# Altium schematic sheet Guidance.SchDoc
size 270 x 306 mm; DocumentNumber: 8; SheetNumber: 8; SheetTotal: 8
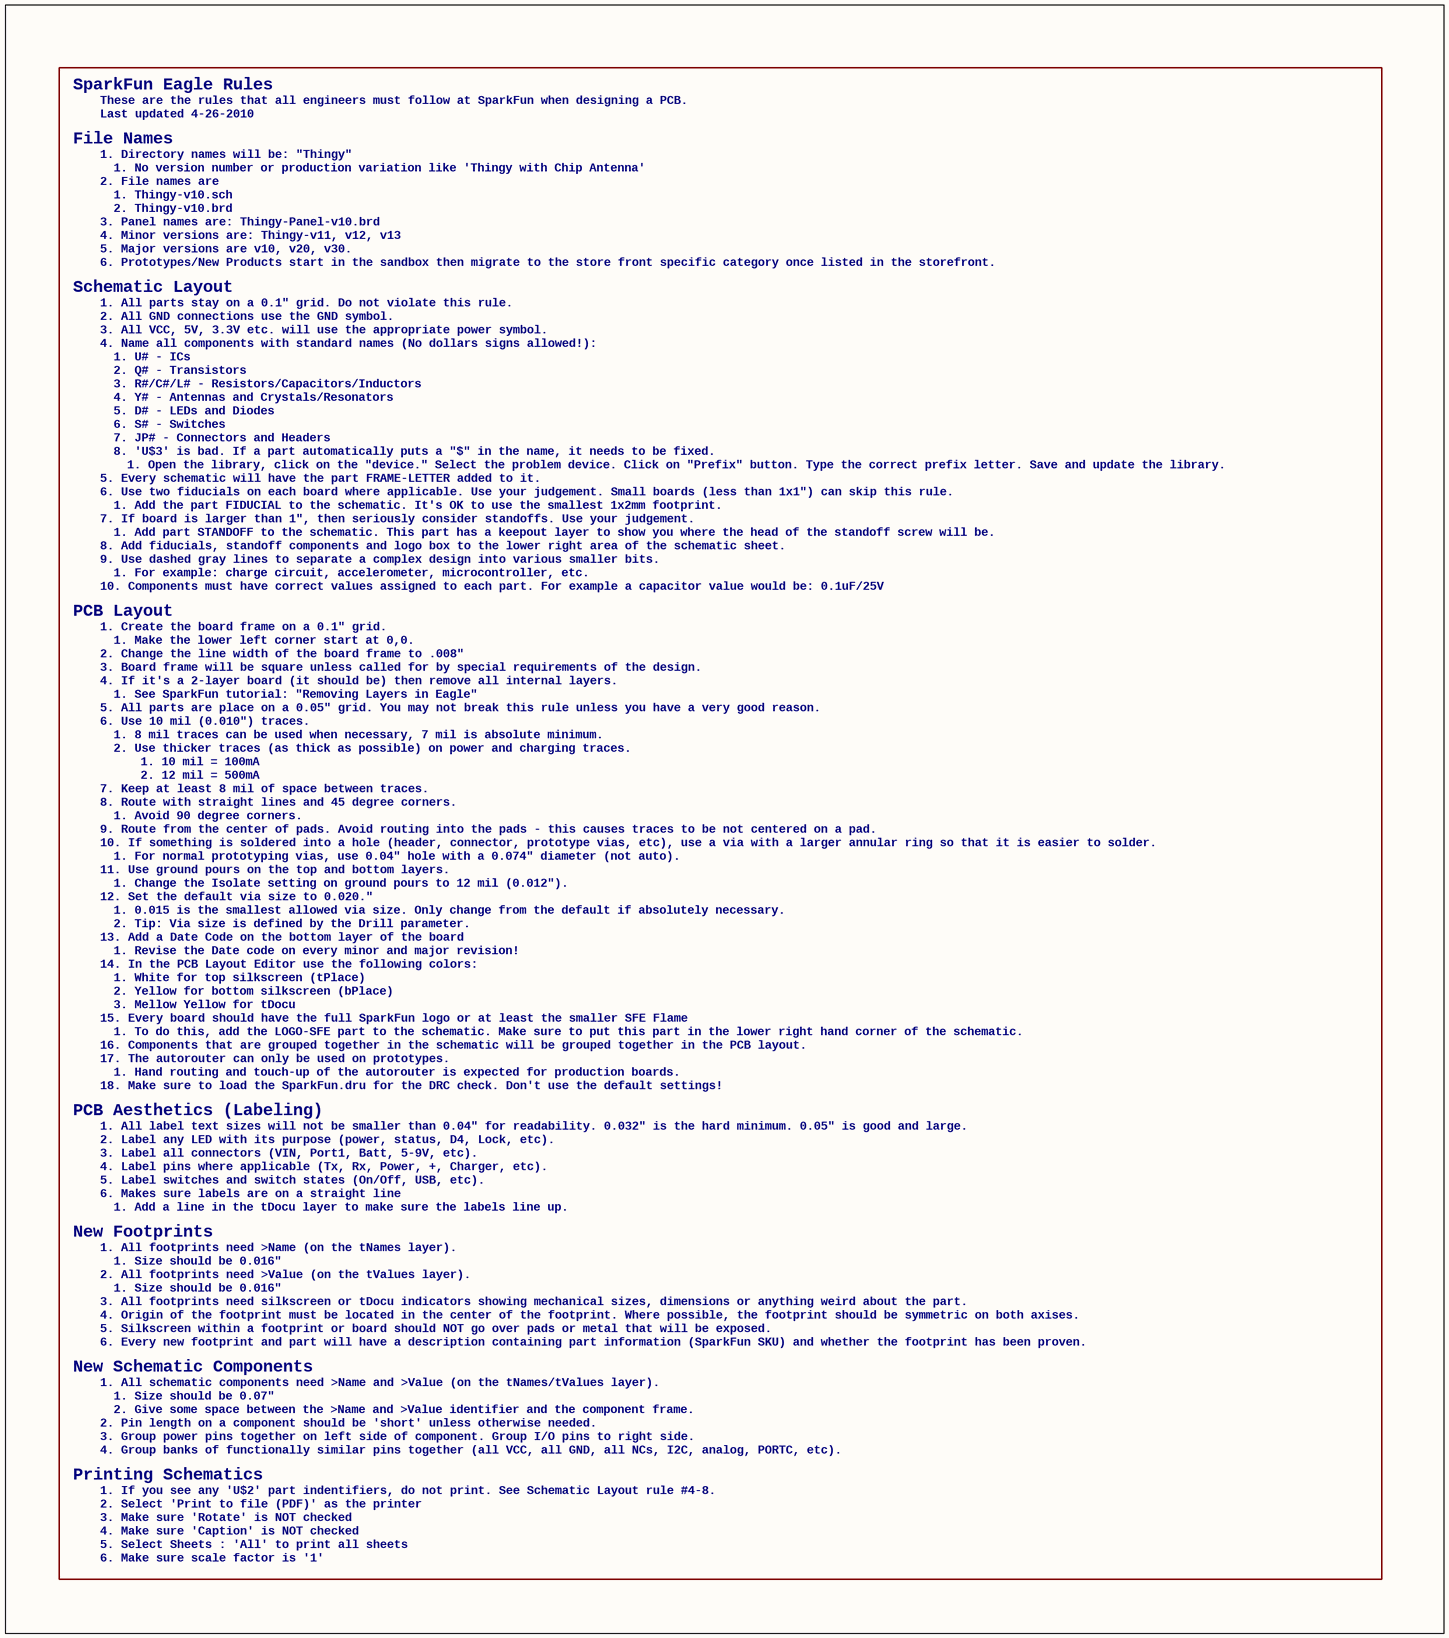
[diagram p0: Guidance.SchDoc]

## Parts
U$5  FileNames: File Names  1.Directorynameswillbe:"Thingy": 1. Directory names will be: "Thingy"  1.Noversionnumberorproductionvariationlike'ThingywithChipAntenna': 1. No version number or production variation like 'Thingy with Chip Antenna'  2.Filenamesare: 2. File names are  1.Thingy-v10.sch: 1. Thingy-v10.sch  2.Thingy-v10.brd: 2. Thingy-v10.brd  3.Panelnamesare:Thingy-Panel-v10.brd: 3. Panel names are: Thingy-Panel-v10.brd  4.Minorversionsare:Thingy-v11,v12,v13: 4. Minor versions are: Thingy-v11, v12, v13  5.Majorversionsarev10,v20,v30.: 5. Major versions are v10, v20, v30.  6.Prototypes/NewProductsstartinthesandboxthenmigratetothestorefrontspecificcategoryoncelistedinthestorefront.: 6. Prototypes/New Products start in the sandbox then migrate to the store front specific category once listed in the storefront.  SchematicLayout: Schematic Layout  1.Allpartsstayona0.1"grid.Donotviolatethisrule.: 1. All parts stay on a 0.1" grid. Do not violate this rule.  2.AllGNDconnectionsusetheGNDsymbol.: 2. All GND connections use the GND symbol.  3.AllVCC,5V,3.3Vetc.willusetheappropriatepowersymbol.: 3. All VCC, 5V, 3.3V etc. will use the appropriate power symbol.  4.Nameallcomponentswithstandardnames(Nodollarssignsallowed!): 4. Name all components with standard names (No dollars signs allowed!):  1.U#-ICs: 1. U# - ICs  2.Q#-Transistors: 2. Q# - Transistors  3.R#/C#/L#-Resistors/Capacitors/Inductors: 3. R#/C#/L# - Resistors/Capacitors/Inductors  4.Y#-AntennasandCrystals/Resonators: 4. Y# - Antennas and Crystals/Resonators  5.D#-LEDsandDiodes: 5. D# - LEDs and Diodes  6.S#-Switches: 6. S# - Switches  7.JP#-ConnectorsandHeaders: 7. JP# - Connectors and Headers  8.'U$3'isbad.Ifapartautomaticallyputsa"$"inthename,itneedstobefixed.: 8. 'U$3' is bad. If a part automatically puts a "$" in the name, it needs to be fixed.  5.EveryschematicwillhavethepartFRAME-LETTERaddedtoit.: 5. Every schematic will have the part FRAME-LETTER added to it.  6.Usetwofiducialsoneachboardwhereapplicable.Useyourjudgement.Smallboards(lessthan1x1")canskipthisrule.: 6. Use two fiducials on each board where applicable. Use your judgement. Small boards (less than 1x1") can skip this rule.  1.AddthepartFIDUCIALtotheschematic.It'sOKtousethesmallest1x2mmfootprint.: 1. Add the part FIDUCIAL to the schematic. It's OK to use the smallest 1x2mm footprint.  7.Ifboardislargerthan1",thenseriouslyconsiderstandoffs.Useyourjudgement.: 7. If board is larger than 1", then seriously consider standoffs. Use your judgement.  1.AddpartSTANDOFFtotheschematic.Thisparthasakeepoutlayertoshowyouwheretheheadofthestandoffscrewwillbe.: 1. Add part STANDOFF to the schematic. This part has a keepout layer to show you where the head of the standoff screw will be.  8.Addfiducials,standoffcomponentsandlogoboxtothelowerrightareaoftheschematicsheet.: 8. Add fiducials, standoff components and logo box to the lower right area of the schematic sheet.  9.Usedashedgraylinestoseparateacomplexdesignintovarioussmallerbits.: 9. Use dashed gray lines to separate a complex design into various smaller bits.  1.Forexample:chargecircuit,accelerometer,microcontroller,etc.: 1. For example: charge circuit, accelerometer, microcontroller, etc.  PCBLayout: PCB Layout  1.Createtheboardframeona0.1"grid.: 1. Create the board frame on a 0.1" grid.  1.Makethelowerleftcornerstartat0,0.: 1. Make the lower left corner start at 0,0.  2.Changethelinewidthoftheboardframeto.008": 2. Change the line width of the board frame to .008"  3.Boardframewillbesquareunlesscalledforbyspecialrequirementsofthedesign.: 3. Board frame will be square unless called for by special requirements of the design.  5.Allpartsareplaceona0.05"grid.Youmaynotbreakthisruleunlessyouhaveaverygoodreason.: 5. All parts are place on a 0.05" grid. You may not break this rule unless you have a very good reason.  6.Use10mil(0.010")traces.: 6. Use 10 mil (0.010") traces.  1.8miltracescanbeusedwhennecessary,7milisabsoluteminimum.: 1. 8 mil traces can be used when necessary, 7 mil is absolute minimum.  2.Usethickertraces(asthickaspossible)onpowerandchargingtraces.: 2. Use thicker traces (as thick as possible) on power and charging traces.  1.10mil=100mA: 1. 10 mil = 100mA  2.12mil=500mA: 2. 12 mil = 500mA  7.Keepatleast8milofspacebetweentraces.: 7. Keep at least 8 mil of space between traces.  8.Routewithstraightlinesand45degreecorners.: 8. Route with straight lines and 45 degree corners.  1.Avoid90degreecorners.: 1. Avoid 90 degree corners.  9.Routefromthecenterofpads.Avoidroutingintothepads-thiscausestracestobenotcenteredonapad.: 9. Route from the center of pads. Avoid routing into the pads - this causes traces to be not centered on a pad.  10.Ifsomethingissolderedintoahole(header,connector,prototypevias,etc),useaviawithalargerannularringsothatitiseasiertosolder.: 10. If something is soldered into a hole (header, connector, prototype vias, etc), use a via with a larger annular ring so that it is easier to solder.  11.Usegroundpoursonthetopandbottomlayers.: 11. Use ground pours on the top and bottom layers.  1.ChangetheIsolatesettingongroundpoursto12mil(0.012").: 1. Change the Isolate setting on ground pours to 12 mil (0.012").  12.Setthedefaultviasizeto0.020.": 12. Set the default via size to 0.020."  1.0.015isthesmallestallowedviasize.Onlychangefromthedefaultifabsolutelynecessary.: 1. 0.015 is the smallest allowed via size. Only change from the default if absolutely necessary.  2.Tip:ViasizeisdefinedbytheDrillparameter.: 2. Tip: Via size is defined by the Drill parameter.  13.AddaDateCodeonthebottomlayeroftheboard: 13. Add a Date Code on the bottom layer of the board  1.RevisetheDatecodeoneveryminorandmajorrevision!: 1. Revise the Date code on every minor and major revision!  14.InthePCBLayoutEditorusethefollowingcolors: 14. In the PCB Layout Editor use the following colors:  1.Whitefortopsilkscreen(tPlace): 1. White for top silkscreen (tPlace)  2.Yellowforbottomsilkscreen(bPlace): 2. Yellow for bottom silkscreen (bPlace)  3.MellowYellowfortDocu: 3. Mellow Yellow for tDocu  15.EveryboardshouldhavethefullSparkFunlogooratleastthesmallerSFEFlame: 15. Every board should have the full SparkFun logo or at least the smaller SFE Flame  1.Todothis,addtheLOGO-SFEparttotheschematic.Makesuretoputthispartinthelowerrighthandcorneroftheschematic.: 1. To do this, add the LOGO-SFE part to the schematic. Make sure to put this part in the lower right hand corner of the schematic.  16.ComponentsthataregroupedtogetherintheschematicwillbegroupedtogetherinthePCBlayout.: 16. Components that are grouped together in the schematic will be grouped together in the PCB layout.  17.Theautoroutercanonlybeusedonprototypes.: 17. The autorouter can only be used on prototypes.  1.Handroutingandtouch-upoftheautorouterisexpectedforproductionboards.: 1. Hand routing and touch-up of the autorouter is expected for production boards.  18.MakesuretoloadtheSparkFun.drufortheDRCcheck.Don'tusethedefaultsettings!: 18. Make sure to load the SparkFun.dru for the DRC check. Don't use the default settings!  PCBAesthetics(Labeling): PCB Aesthetics (Labeling)  2.LabelanyLEDwithitspurpose(power,status,D4,Lock,etc).: 2. Label any LED with its purpose (power, status, D4, Lock, etc).  3.Labelallconnectors(VIN,Port1,Batt,5-9V,etc).: 3. Label all connectors (VIN, Port1, Batt, 5-9V, etc).  4.Labelpinswhereapplicable(Tx,Rx,Power,+,Charger,etc).: 4. Label pins where applicable (Tx, Rx, Power, +, Charger, etc).  5.Labelswitchesandswitchstates(On/Off,USB,etc).: 5. Label switches and switch states (On/Off, USB, etc).  6.Makessurelabelsareonastraightline: 6. Makes sure labels are on a straight line  1.AddalineinthetDoculayertomakesurethelabelslineup.: 1. Add a line in the tDocu layer to make sure the labels line up.  NewFootprints: New Footprints  1.Allfootprintsneed>Name(onthetNameslayer).: 1. All footprints need >Name (on the tNames layer).  1.Sizeshouldbe0.016": 1. Size should be 0.016"  2.Allfootprintsneed>Value(onthetValueslayer).: 2. All footprints need >Value (on the tValues layer).  3.AllfootprintsneedsilkscreenortDocuindicatorsshowingmechanicalsizes,dimensionsoranythingweirdaboutthepart.: 3. All footprints need silkscreen or tDocu indicators showing mechanical sizes, dimensions or anything weird about the part.  5.SilkscreenwithinafootprintorboardshouldNOTgooverpadsormetalthatwillbeexposed.: 5. Silkscreen within a footprint or board should NOT go over pads or metal that will be exposed.  6.Everynewfootprintandpartwillhaveadescriptioncontainingpartinformation(SparkFunSKU)andwhetherthefootprinthasbeenproven.: 6. Every new footprint and part will have a description containing part information (SparkFun SKU) and whether the footprint has been proven.  1.Openthelibrary,clickonthe"device."Selecttheproblemdevice.Clickon"Prefix"button.Typethecorrectprefixletter.Saveandupdatethelibrary.: 1. Open the library, click on the "device." Select the problem device. Click on "Prefix" button. Type the correct prefix letter. Save and update the library.  1.Fornormalprototypingvias,use0.04"holewitha0.074"diameter(notauto).: 1. For normal prototyping vias, use 0.04" hole with a 0.074" diameter (not auto).  NewSchematicComponents: New Schematic Components  1.Allschematiccomponentsneed>Nameand>Value(onthetNames/tValueslayer).: 1. All schematic components need >Name and >Value (on the tNames/tValues layer).  1.Sizeshouldbe0.07": 1. Size should be 0.07"  2.Pinlengthonacomponentshouldbe'short'unlessotherwiseneeded.: 2. Pin length on a component should be 'short' unless otherwise needed.  4.Ifit'sa2-layerboard(itshouldbe)thenremoveallinternallayers.: 4. If it's a 2-layer board (it should be) then remove all internal layers.  1.SeeSparkFuntutorial:"RemovingLayersinEagle": 1. See SparkFun tutorial: "Removing Layers in Eagle"  2.Givesomespacebetweenthe>Nameand>Valueidentifierandthecomponentframe.: 2. Give some space between the >Name and >Value identifier and the component frame.  PrintingSchematics: Printing Schematics  2.Select'Printtofile(PDF)'astheprinter: 2. Select 'Print to file (PDF)' as the printer  3.Makesure'Rotate'isNOTchecked: 3. Make sure 'Rotate' is NOT checked  4.Makesure'Caption'isNOTchecked: 4. Make sure 'Caption' is NOT checked  5.SelectSheets:'All'toprintallsheets: 5. Select Sheets : 'All' to print all sheets  6.Makesurescalefactoris'1': 6. Make sure scale factor is '1'  1.Ifyouseeany'U$2'partindentifiers,donotprint.SeeSchematicLayoutrule#4-8.: 1. If you see any 'U$2' part indentifiers, do not print. See Schematic Layout rule #4-8.  SparkFunEagleRules: SparkFun Eagle Rules  ThesearetherulesthatallengineersmustfollowatSparkFunwhendesigningaPCB.: These are the rules that all engineers must follow at SparkFun when designing a PCB.  Lastupdated4-26-2010: Last updated 4-26-2010  1.Alllabeltextsizeswillnotbesmallerthan0.04"forreadability.0.032"isthehardminimum.0.05"isgoodandlarge.: 1. All label text sizes will not be smaller than 0.04" for readability. 0.032" is the hard minimum. 0.05" is good and large.  3.Grouppowerpinstogetheronleftsideofcomponent.GroupI/Opinstorightside.: 3. Group power pins together on left side of component. Group I/O pins to right side.  4.Groupbanksoffunctionallysimilarpinstogether(allVCC,allGND,allNCs,I2C,analog,PORTC,etc).: 4. Group banks of functionally similar pins together (all VCC, all GND, all NCs, I2C, analog, PORTC, etc).  10.Componentsmusthavecorrectvaluesassignedtoeachpart.Forexampleacapacitorvaluewouldbe:0.1uF/25V: 10. Components must have correct values assigned to each part. For example a capacitor value would be: 0.1uF/25V  4.Originofthefootprintmustbelocatedinthecenterofthefootprint.Wherepossible,thefootprintshouldbesymmetriconbothaxises.: 4. Origin of the footprint must be located in the center of the footprint. Where possible, the footprint should be symmetric on both axises.  (hidden comment: SPARKFUN-EAGLE-RULES)

## Library data of the parts
U$5 = SPARKFUN-EAGLE-RULES: Description: These are the default rules that SparkFun engineers must follow. We highly recommend following these rules as well.